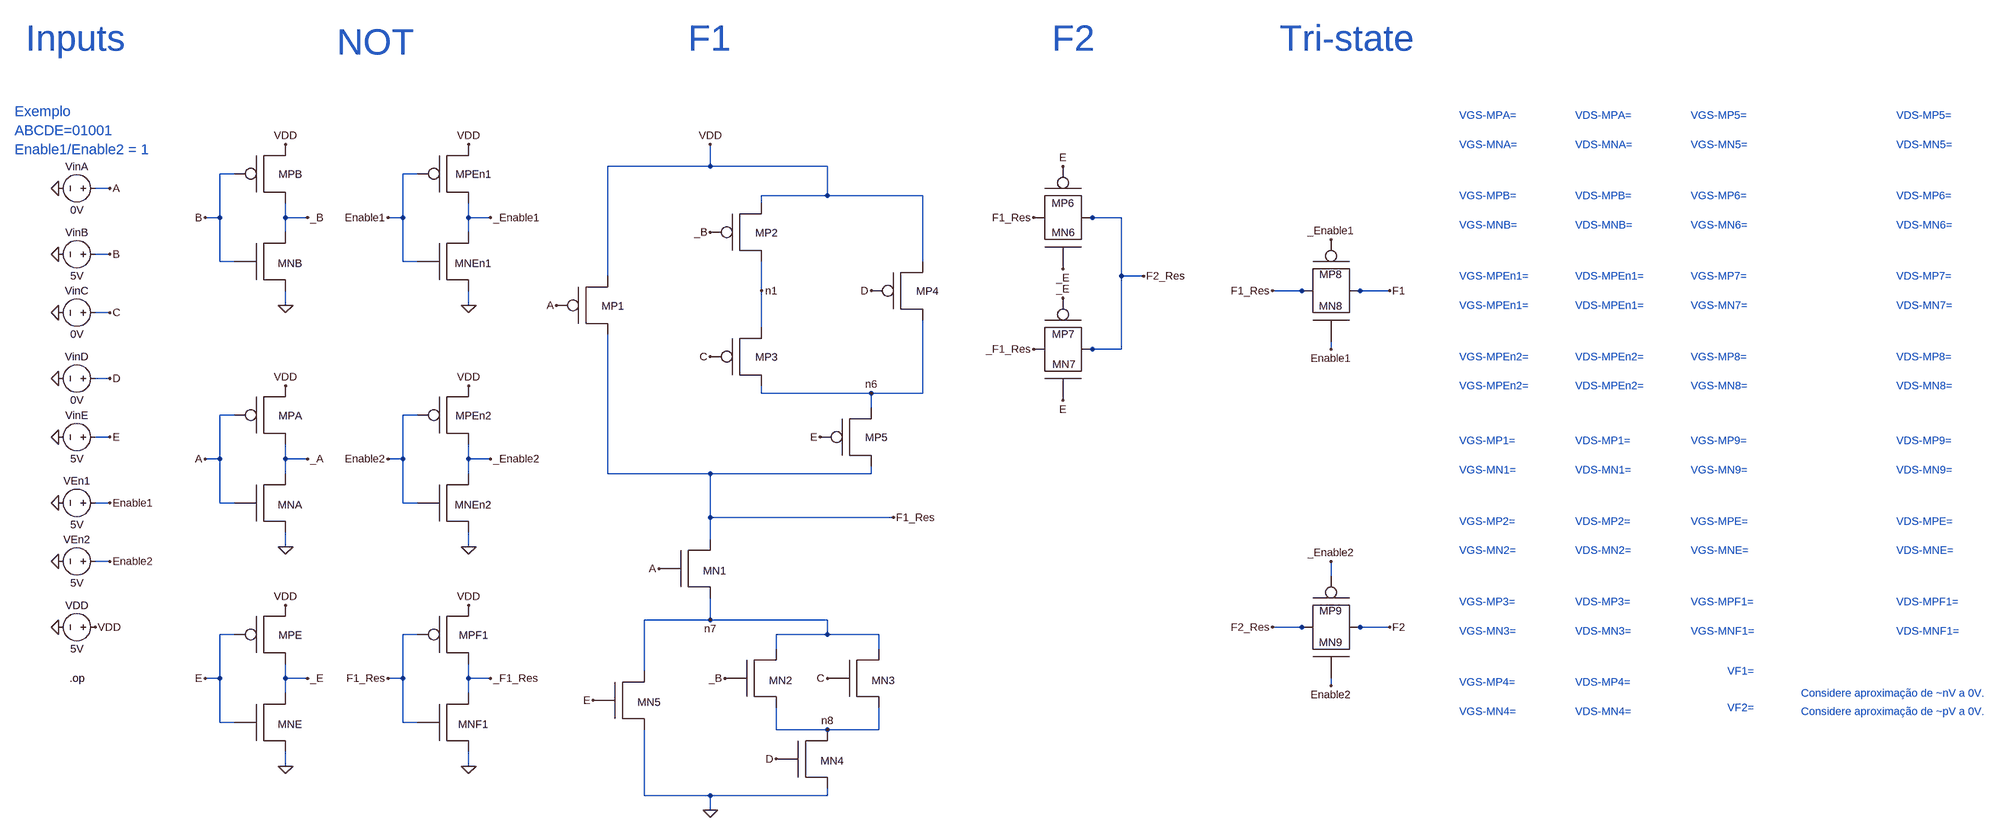
[diagram p0: schematic VGS_VDS.asc]
VGS_VDS.asc, the LTspice schematic file:
Version 4
SHEET 1 4064 2108
WIRE -32 -560 -32 -608
WIRE -32 -560 -256 -560
WIRE 224 -560 -32 -560
WIRE -1072 -544 -1104 -544
WIRE -672 -544 -704 -544
WIRE -1344 -512 -1376 -512
WIRE 224 -496 224 -560
WIRE 224 -496 80 -496
WIRE 432 -496 224 -496
WIRE 80 -480 80 -496
WIRE -1104 -448 -1104 -544
WIRE -1104 -448 -1136 -448
WIRE -960 -448 -960 -480
WIRE -912 -448 -960 -448
WIRE -704 -448 -704 -544
WIRE -704 -448 -736 -448
WIRE -560 -448 -560 -480
WIRE -512 -448 -560 -448
WIRE 896 -448 880 -448
WIRE 960 -448 896 -448
WIRE -960 -416 -960 -448
WIRE -560 -416 -560 -448
WIRE -1344 -368 -1376 -368
WIRE -1104 -352 -1104 -448
WIRE -1072 -352 -1104 -352
WIRE -704 -352 -704 -448
WIRE -672 -352 -704 -352
WIRE 432 -352 432 -496
WIRE -256 -320 -256 -560
WIRE 960 -320 960 -448
WIRE 1008 -320 960 -320
WIRE 80 -288 80 -352
WIRE 1392 -288 1328 -288
WIRE 1584 -288 1520 -288
WIRE -960 -256 -960 -288
WIRE -560 -256 -560 -288
WIRE -1344 -240 -1376 -240
WIRE 80 -208 80 -288
WIRE 896 -160 880 -160
WIRE 960 -160 960 -320
WIRE 960 -160 896 -160
WIRE 1456 -160 1456 -176
WIRE -1344 -96 -1376 -96
WIRE 80 -64 80 -80
WIRE 320 -64 80 -64
WIRE 432 -64 432 -224
WIRE 432 -64 320 -64
WIRE 320 -32 320 -64
WIRE -1072 -16 -1104 -16
WIRE -672 -16 -704 -16
WIRE -1344 32 -1376 32
WIRE -1104 80 -1104 -16
WIRE -1104 80 -1136 80
WIRE -960 80 -960 48
WIRE -912 80 -960 80
WIRE -704 80 -704 -16
WIRE -704 80 -736 80
WIRE -560 80 -560 48
WIRE -512 80 -560 80
WIRE -960 112 -960 80
WIRE -560 112 -560 80
WIRE -256 112 -256 -192
WIRE -32 112 -256 112
WIRE 320 112 320 96
WIRE 320 112 -32 112
WIRE -1344 176 -1376 176
WIRE -1104 176 -1104 80
WIRE -1072 176 -1104 176
WIRE -704 176 -704 80
WIRE -672 176 -704 176
WIRE -32 208 -32 112
WIRE 368 208 -32 208
WIRE -32 256 -32 208
WIRE -960 272 -960 240
WIRE -560 272 -560 240
WIRE -1344 304 -1376 304
WIRE 1456 336 1456 304
WIRE -32 432 -32 384
WIRE -32 432 -176 432
WIRE 224 432 -32 432
WIRE 1392 448 1328 448
WIRE 1584 448 1520 448
WIRE -1072 464 -1104 464
WIRE -672 464 -704 464
WIRE 224 464 224 432
WIRE 224 464 112 464
WIRE 336 464 224 464
WIRE 112 496 112 464
WIRE 336 496 336 464
WIRE -176 544 -176 432
WIRE -1104 560 -1104 464
WIRE -1104 560 -1136 560
WIRE -960 560 -960 528
WIRE -912 560 -960 560
WIRE -704 560 -704 464
WIRE -704 560 -736 560
WIRE -560 560 -560 528
WIRE -512 560 -560 560
WIRE 1456 576 1456 560
WIRE -960 592 -960 560
WIRE -560 592 -560 560
WIRE -1104 656 -1104 560
WIRE -1072 656 -1104 656
WIRE -704 656 -704 560
WIRE -672 656 -704 656
WIRE 112 672 112 624
WIRE 224 672 112 672
WIRE 336 672 336 624
WIRE 336 672 224 672
WIRE -960 752 -960 720
WIRE -560 752 -560 720
WIRE -176 816 -176 672
WIRE -32 816 -176 816
WIRE 224 816 224 800
WIRE 224 816 -32 816
WIRE -32 848 -32 816
FLAG -368 -256 A
FLAG -32 -144 C
FLAG 320 -288 D
FLAG 208 32 E
FLAG -144 320 A
FLAG -288 608 E
FLAG 224 560 C
FLAG 112 736 D
FLAG -32 848 0
FLAG 368 208 F1_Res
FLAG -32 -608 VDD
FLAG -32 -416 _B
FLAG 0 560 _B
FLAG -1136 -448 B
FLAG -912 -448 _B
FLAG -960 -256 0
FLAG -912 80 _A
FLAG -960 272 0
FLAG -1456 448 0
FLAG -1376 448 VDD
FLAG -960 -608 VDD
FLAG -960 -80 VDD
FLAG -1344 -512 A
FLAG 1328 -288 F1_Res
FLAG 1584 -288 F1
FLAG 1456 576 Enable2
FLAG 1328 448 F2_Res
FLAG 1584 448 F2
FLAG 1456 304 _Enable2
FLAG -736 -448 Enable1
FLAG -512 -448 _Enable1
FLAG -560 -256 0
FLAG -736 80 Enable2
FLAG -512 80 _Enable2
FLAG -560 272 0
FLAG -560 -608 VDD
FLAG -560 -80 VDD
FLAG 1456 -160 Enable1
FLAG 1456 -400 _Enable1
FLAG 80 -288 n1
FLAG -1456 -512 0
FLAG -1344 -368 B
FLAG -1456 -368 0
FLAG -1344 -240 C
FLAG -1456 -240 0
FLAG -1344 -96 D
FLAG -1456 -96 0
FLAG -1344 32 E
FLAG -1456 32 0
FLAG -1344 176 Enable1
FLAG -1456 176 0
FLAG -1344 304 Enable2
FLAG -1456 304 0
FLAG -1136 80 A
FLAG 320 -64 n6
FLAG -32 432 n7
FLAG 224 672 n8
FLAG -1136 560 E
FLAG -912 560 _E
FLAG -960 752 0
FLAG -960 400 VDD
FLAG -736 560 F1_Res
FLAG -512 560 _F1_Res
FLAG -560 752 0
FLAG -560 400 VDD
FLAG 1008 -320 F2_Res
FLAG 768 -448 F1_Res
FLAG 768 -160 _F1_Res
FLAG 832 -560 E
FLAG 832 -336 _E
FLAG 832 -272 _E
FLAG 832 -48 E
DATAFLAG 2784 -656 "V(_a)-V(vdd)"
DATAFLAG 2784 -592 "V(_a)"
DATAFLAG 2784 -480 "V(_b)-V(vdd)"
DATAFLAG 2816 -416 "V(_b)"
DATAFLAG 2800 -304 "V(_enable1)-V(vdd)"
DATAFLAG 2848 -240 "V(_enable1)"
DATAFLAG 2800 -128 "V(_enable2)-V(vdd)"
DATAFLAG 2832 -64 "V(_enable2)"
DATAFLAG 2816 48 "V(f1_res)-V(vdd)"
DATAFLAG 2768 112 "V(f1_res)-V(n7)"
DATAFLAG 2768 224 "V(n1)-V(vdd)"
DATAFLAG 2816 288 "V(n7)-V(n8)"
DATAFLAG 2768 400 "V(n6)-V(n1)"
DATAFLAG 2800 464 "V(n7)-V(n8)"
DATAFLAG 2768 576 "V(n6)-V(vdd)"
DATAFLAG 2816 640 "V(n8)"
DATAFLAG 3952 -656 "V(f1_res)-V(n6)"
DATAFLAG 3952 -592 "V(n7)"
DATAFLAG 3904 -480 "V(f1_res)-V(f2_res)"
DATAFLAG 3904 -416 "V(f1_res)-V(f2_res)"
DATAFLAG 3952 -304 "V(_f1_res)-V(f2_res)"
DATAFLAG 3952 -240 "V(_f1_res)-V(f2_res)"
DATAFLAG 3952 -128 "V(f1_res)-V(f1)"
DATAFLAG 3952 -64 "V(f1_res)-V(f1)"
DATAFLAG 3952 48 "V(f2_res)-V(f2)"
DATAFLAG 3952 112 "V(f2_res)-V(f2)"
DATAFLAG 3968 224 "V(_e)-V(vdd)"
DATAFLAG 3968 288 "V(_e)"
DATAFLAG 3968 400 "V(_f1_res)-V(vdd)"
DATAFLAG 3968 464 "V(_f1_res)"
DATAFLAG 2032 -656 "V(a)-V(vdd)"
DATAFLAG 2032 -592 "V(a)"
DATAFLAG 2032 -480 "V(b)-V(vdd)"
DATAFLAG 2032 -416 "V(b)"
DATAFLAG 2048 -304 "V(enable1)-V(vdd)"
DATAFLAG 2048 -240 "V(enable1)"
DATAFLAG 2048 -128 "V(enable2)-V(vdd)"
DATAFLAG 2048 -64 "V(enable2)"
DATAFLAG 2032 48 "V(a)-V(vdd)"
DATAFLAG 2032 112 "V(a)"
DATAFLAG 2048 224 "V(_b)-V(vdd)"
DATAFLAG 2064 288 "V(_b)"
DATAFLAG 2032 400 "V(c)-V(n1)"
DATAFLAG 2032 464 "V(c)"
DATAFLAG 2032 576 "V(d)-V(vdd)"
DATAFLAG 2032 640 "V(d)"
DATAFLAG 3168 -656 "V(e)-V(n6)"
DATAFLAG 3168 -592 "V(e)"
DATAFLAG 3168 -480 "V(e)-V(f2_res)"
DATAFLAG 3216 -416 "V(_e)-V(f2_res)"
DATAFLAG 3216 -304 "V(_e)-V(f2_res)"
DATAFLAG 3168 -240 "V(e)-V(f2_res)"
DATAFLAG 3168 -128 "V(b)-V(vdd)"
DATAFLAG 3168 -64 "V(b)"
DATAFLAG 3168 48 "V(_b)-V(vdd)"
DATAFLAG 3200 112 "V(_b)"
DATAFLAG 3168 224 "V(e)-V(vdd)"
DATAFLAG 3168 288 "V(e)"
DATAFLAG 3216 400 "V(f1_res)-V(vdd)"
DATAFLAG 3216 464 "V(f1_res)"
DATAFLAG 3168 560 "V(f1)"
DATAFLAG 3200 640 "V(f2)"
SYMBOL PMOSX -288 -272 R0
SYMATTR InstName MP1
SYMBOL PMOSX 48 -432 R0
SYMATTR InstName MP2
SYMBOL PMOSX 48 -160 R0
SYMATTR InstName MP3
SYMBOL PMOSX 400 -304 R0
SYMATTR InstName MP4
SYMBOL PMOSX 288 16 R0
SYMATTR InstName MP5
SYMBOL NMOSX -64 304 R0
SYMATTR InstName MN1
SYMBOL NMOSX 80 544 R0
SYMATTR InstName MN2
SYMBOL NMOSX 304 544 R0
SYMATTR InstName MN3
SYMBOL NMOSX 192 720 R0
SYMATTR InstName MN4
SYMBOL NMOSX -208 592 R0
SYMATTR InstName MN5
SYMBOL NMOSX -992 -368 R0
SYMATTR InstName MNB
SYMBOL PMOSX -992 -560 R0
SYMATTR InstName MPB
SYMBOL NMOSX -992 160 R0
SYMATTR InstName MNA
SYMBOL PMOSX -992 -32 R0
SYMATTR InstName MPA
SYMBOL voltage -1360 448 R90
WINDOW 0 -32 56 VBottom 2
WINDOW 3 32 56 VTop 2
WINDOW 123 0 0 Left 0
WINDOW 39 0 0 Left 0
SYMATTR InstName VDD
SYMATTR Value 5V
SYMBOL NMOSX 1440 -256 R270
WINDOW 0 52 15 VTop 2
SYMATTR InstName MP8
SYMBOL PMOSX 1472 -320 R90
WINDOW 0 50 17 VTop 2
SYMATTR InstName MN8
SYMBOL NMOSX 1440 480 R270
WINDOW 0 52 15 VTop 2
SYMATTR InstName MP9
SYMBOL PMOSX 1472 416 R90
WINDOW 0 50 17 VTop 2
SYMATTR InstName MN9
SYMBOL NMOSX -592 -368 R0
SYMATTR InstName MNEn1
SYMBOL PMOSX -592 -560 R0
SYMATTR InstName MPEn1
SYMBOL NMOSX -592 160 R0
SYMATTR InstName MNEn2
SYMBOL PMOSX -592 -32 R0
SYMATTR InstName MPEn2
SYMBOL voltage -1360 -512 R90
WINDOW 0 -32 56 VBottom 2
WINDOW 3 32 56 VTop 2
WINDOW 123 0 0 Left 0
WINDOW 39 0 0 Left 0
SYMATTR InstName VinA
SYMATTR Value 0V
SYMBOL voltage -1360 -368 R90
WINDOW 0 -32 56 VBottom 2
WINDOW 3 32 56 VTop 2
WINDOW 123 0 0 Left 0
WINDOW 39 0 0 Left 0
SYMATTR InstName VinB
SYMATTR Value 5V
SYMBOL voltage -1360 -240 R90
WINDOW 0 -32 56 VBottom 2
WINDOW 3 32 56 VTop 2
WINDOW 123 0 0 Left 0
WINDOW 39 0 0 Left 0
SYMATTR InstName VinC
SYMATTR Value 0V
SYMBOL voltage -1360 -96 R90
WINDOW 0 -32 56 VBottom 2
WINDOW 3 32 56 VTop 2
WINDOW 123 0 0 Left 0
WINDOW 39 0 0 Left 0
SYMATTR InstName VinD
SYMATTR Value 0V
SYMBOL voltage -1360 32 R90
WINDOW 0 -32 56 VBottom 2
WINDOW 3 32 56 VTop 2
WINDOW 123 0 0 Left 0
WINDOW 39 0 0 Left 0
SYMATTR InstName VinE
SYMATTR Value 5V
SYMBOL voltage -1360 176 R90
WINDOW 0 -32 56 VBottom 2
WINDOW 3 32 56 VTop 2
WINDOW 123 0 0 Left 0
WINDOW 39 0 0 Left 0
SYMATTR InstName VEn1
SYMATTR Value 5V
SYMBOL voltage -1360 304 R90
WINDOW 0 -32 56 VBottom 2
WINDOW 3 32 56 VTop 2
WINDOW 123 0 0 Left 0
WINDOW 39 0 0 Left 0
SYMATTR InstName VEn2
SYMATTR Value 5V
SYMBOL NMOSX -992 640 R0
SYMATTR InstName MNE
SYMBOL PMOSX -992 448 R0
SYMATTR InstName MPE
SYMBOL NMOSX -592 640 R0
SYMATTR InstName MNF1
SYMBOL PMOSX -592 448 R0
SYMATTR InstName MPF1
SYMBOL NMOSX 816 -416 R270
WINDOW 0 -16 17 VTop 2
SYMATTR InstName MN6
SYMBOL NMOSX 816 -128 R270
WINDOW 0 -17 18 VTop 2
SYMATTR InstName MN7
SYMBOL PMOSX 848 -480 R90
WINDOW 0 -15 16 VTop 2
SYMATTR InstName MP6
SYMBOL PMOSX 848 -192 R90
WINDOW 0 -16 15 VTop 2
SYMATTR InstName MP7
TEXT -80 -840 Left 6 ;F1
TEXT 808 -840 Left 6 ;F2
TEXT -848 -832 Left 6 ;NOT
TEXT -1528 -840 Left 6 ;Inputs
TEXT -1552 -680 Left 3 ;Exemplo \nABCDE=01001\nEnable1/Enable2 = 1
TEXT -1432 560 Left 2 !.op
TEXT 1856 -672 Left 2 ;VGS-MPA=
TEXT 1856 -608 Left 2 ;VGS-MNA=
TEXT 1856 -496 Left 2 ;VGS-MPB=
TEXT 1856 -432 Left 2 ;VGS-MNB=
TEXT 1856 -320 Left 2 ;VGS-MPEn1=
TEXT 1856 -256 Left 2 ;VGS-MPEn1=
TEXT 1856 -144 Left 2 ;VGS-MPEn2=
TEXT 1856 -80 Left 2 ;VGS-MPEn2=
TEXT 1856 40 Left 2 ;VGS-MP1=
TEXT 1856 104 Left 2 ;VGS-MN1=
TEXT 1856 216 Left 2 ;VGS-MP2=
TEXT 1856 280 Left 2 ;VGS-MN2=
TEXT 1856 392 Left 2 ;VGS-MP3=
TEXT 1856 456 Left 2 ;VGS-MN3=
TEXT 1856 568 Left 2 ;VGS-MP4=
TEXT 1856 632 Left 2 ;VGS-MN4=
TEXT 2992 -672 Left 2 ;VGS-MP5=
TEXT 2992 -608 Left 2 ;VGS-MN5=
TEXT 2992 -496 Left 2 ;VGS-MP6=
TEXT 2992 -432 Left 2 ;VGS-MN6=
TEXT 2992 -320 Left 2 ;VGS-MP7=
TEXT 2992 -256 Left 2 ;VGS-MN7=
TEXT 2992 -144 Left 2 ;VGS-MP8=
TEXT 2992 -80 Left 2 ;VGS-MN8=
TEXT 2992 40 Left 2 ;VGS-MP9=
TEXT 2992 104 Left 2 ;VGS-MN9=
TEXT 2992 216 Left 2 ;VGS-MPE=
TEXT 2992 280 Left 2 ;VGS-MNE=
TEXT 2992 392 Left 2 ;VGS-MPF1=
TEXT 2992 456 Left 2 ;VGS-MNF1=
TEXT 2600 -672 Left 2 ;VDS-MPA=
TEXT 2600 -608 Left 2 ;VDS-MNA=
TEXT 2600 -496 Left 2 ;VDS-MPB=
TEXT 2600 -432 Left 2 ;VDS-MNB=
TEXT 2600 -320 Left 2 ;VDS-MPEn1=
TEXT 2600 -256 Left 2 ;VDS-MPEn1=
TEXT 2600 -144 Left 2 ;VDS-MPEn2=
TEXT 2600 -80 Left 2 ;VDS-MPEn2=
TEXT 2600 40 Left 2 ;VDS-MP1=
TEXT 2600 104 Left 2 ;VDS-MN1=
TEXT 2600 216 Left 2 ;VDS-MP2=
TEXT 2600 280 Left 2 ;VDS-MN2=
TEXT 2600 392 Left 2 ;VDS-MP3=
TEXT 2600 456 Left 2 ;VDS-MN3=
TEXT 2600 568 Left 2 ;VDS-MP4=
TEXT 2600 632 Left 2 ;VDS-MN4=
TEXT 3736 -672 Left 2 ;VDS-MP5=
TEXT 3736 -608 Left 2 ;VDS-MN5=
TEXT 3736 -496 Left 2 ;VDS-MP6=
TEXT 3736 -432 Left 2 ;VDS-MN6=
TEXT 3736 -320 Left 2 ;VDS-MP7=
TEXT 3736 -256 Left 2 ;VDS-MN7=
TEXT 3736 -144 Left 2 ;VDS-MP8=
TEXT 3736 -80 Left 2 ;VDS-MN8=
TEXT 3736 40 Left 2 ;VDS-MP9=
TEXT 3736 104 Left 2 ;VDS-MN9=
TEXT 3736 216 Left 2 ;VDS-MPE=
TEXT 3736 280 Left 2 ;VDS-MNE=
TEXT 3736 392 Left 2 ;VDS-MPF1=
TEXT 3736 456 Left 2 ;VDS-MNF1=
TEXT 3072 544 Left 2 ;VF1=
TEXT 3072 624 Left 2 ;VF2=
TEXT 1344 -840 Left 6 ;Tri-state
TEXT 3528 592 Left 2 ;Considere aproximação de ~nV a 0V.
TEXT 3528 632 Left 2 ;Considere aproximação de ~pV a 0V.

The netlist it stands for:
* VGS_VDS.asc
XMP1 F1_Res A VDD PMOSX  ; pins D G S
XMP2 n1 _B VDD PMOSX  ; pins D G S
XMP3 n6 C n1 PMOSX  ; pins D G S
XMP4 n6 D VDD PMOSX  ; pins D G S
XMP5 F1_Res E n6 PMOSX  ; pins D G S
XMN1 F1_Res A n7 NMOSX  ; pins D G S
XMN2 n7 _B n8 NMOSX  ; pins D G S
XMN3 n7 C n8 NMOSX  ; pins D G S
XMN4 n8 D 0 NMOSX  ; pins D G S
XMN5 n7 E 0 NMOSX  ; pins D G S
XMNB _B B 0 NMOSX  ; pins D G S
XMPB _B B VDD PMOSX  ; pins D G S
XMNA _A A 0 NMOSX  ; pins D G S
XMPA _A A VDD PMOSX  ; pins D G S
VDD VDD 0 5V
XMP8 F1_Res Enable1 F1 NMOSX  ; pins D G S
XMN8 F1_Res _Enable1 F1 PMOSX  ; pins D G S
XMP9 F2_Res Enable2 F2 NMOSX  ; pins D G S
XMN9 F2_Res _Enable2 F2 PMOSX  ; pins D G S
XMNEn1 _Enable1 Enable1 0 NMOSX  ; pins D G S
XMPEn1 _Enable1 Enable1 VDD PMOSX  ; pins D G S
XMNEn2 _Enable2 Enable2 0 NMOSX  ; pins D G S
XMPEn2 _Enable2 Enable2 VDD PMOSX  ; pins D G S
VinA A 0 0V
VinB B 0 5V
VinC C 0 0V
VinD D 0 0V
VinE E 0 5V
VEn1 Enable1 0 5V
VEn2 Enable2 0 5V
XMNE _E E 0 NMOSX  ; pins D G S
XMPE _E E VDD PMOSX  ; pins D G S
XMNF1 _F1_Res F1_Res 0 NMOSX  ; pins D G S
XMPF1 _F1_Res F1_Res VDD PMOSX  ; pins D G S
XMN6 F1_Res _E F2_Res NMOSX  ; pins D G S
XMN7 _F1_Res E F2_Res NMOSX  ; pins D G S
XMP6 F1_Res E F2_Res PMOSX  ; pins D G S
XMP7 _F1_Res _E F2_Res PMOSX  ; pins D G S
* F1
* F2
* NOT
* Inputs
* Exemplo
* ABCDE=01001
* Enable1/Enable2 = 1
.op
* VGS-MPA=
* VGS-MNA=
* VGS-MPB=
* VGS-MNB=
* VGS-MPEn1=
* VGS-MPEn1=
* VGS-MPEn2=
* VGS-MPEn2=
* VGS-MP1=
* VGS-MN1=
* VGS-MP2=
* VGS-MN2=
* VGS-MP3=
* VGS-MN3=
* VGS-MP4=
* VGS-MN4=
* VGS-MP5=
* VGS-MN5=
* VGS-MP6=
* VGS-MN6=
* VGS-MP7=
* VGS-MN7=
* VGS-MP8=
* VGS-MN8=
* VGS-MP9=
* VGS-MN9=
* VGS-MPE=
* VGS-MNE=
* VGS-MPF1=
* VGS-MNF1=
* VDS-MPA=
* VDS-MNA=
* VDS-MPB=
* VDS-MNB=
* VDS-MPEn1=
* VDS-MPEn1=
* VDS-MPEn2=
* VDS-MPEn2=
* VDS-MP1=
* VDS-MN1=
* VDS-MP2=
* VDS-MN2=
* VDS-MP3=
* VDS-MN3=
* VDS-MP4=
* VDS-MN4=
* VDS-MP5=
* VDS-MN5=
* VDS-MP6=
* VDS-MN6=
* VDS-MP7=
* VDS-MN7=
* VDS-MP8=
* VDS-MN8=
* VDS-MP9=
* VDS-MN9=
* VDS-MPE=
* VDS-MNE=
* VDS-MPF1=
* VDS-MNF1=
* VF1=
* VF2=
* Tri-state
* Considere aproximação de ~nV a 0V.
* Considere aproximação de ~pV a 0V.
.backanno
.end